# Altium schematic sheet V1.0.SchDoc
size 762 x 355 mm; SheetTotal: 3
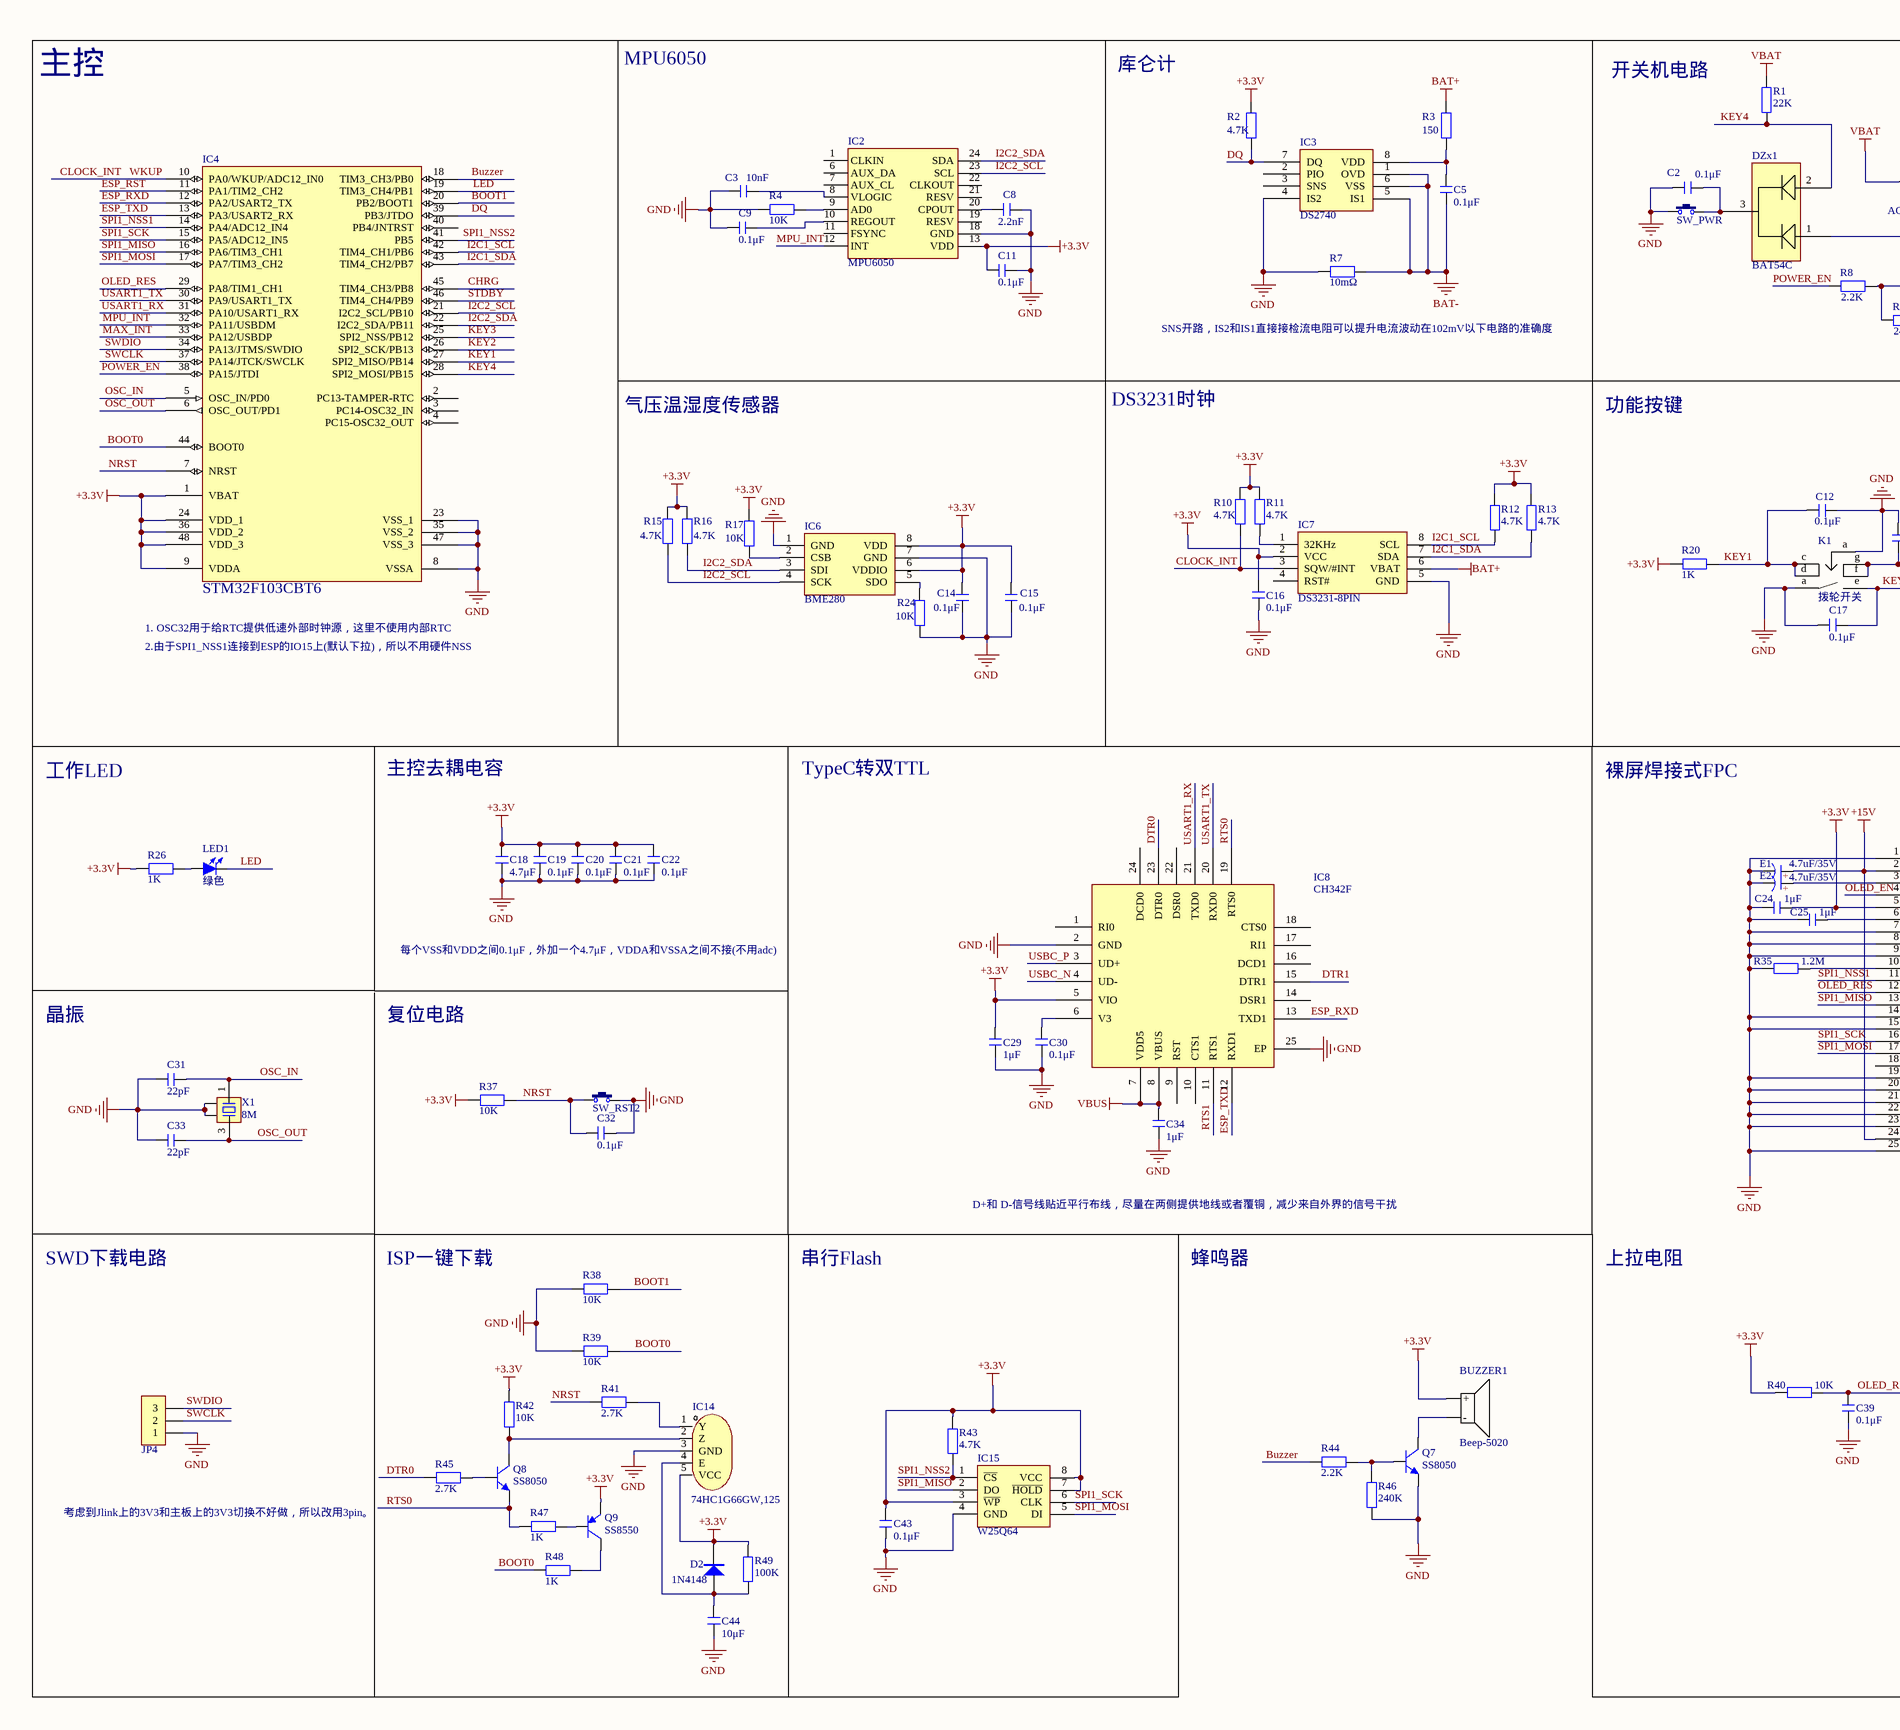
[diagram p0: V1.0.SchDoc, left]
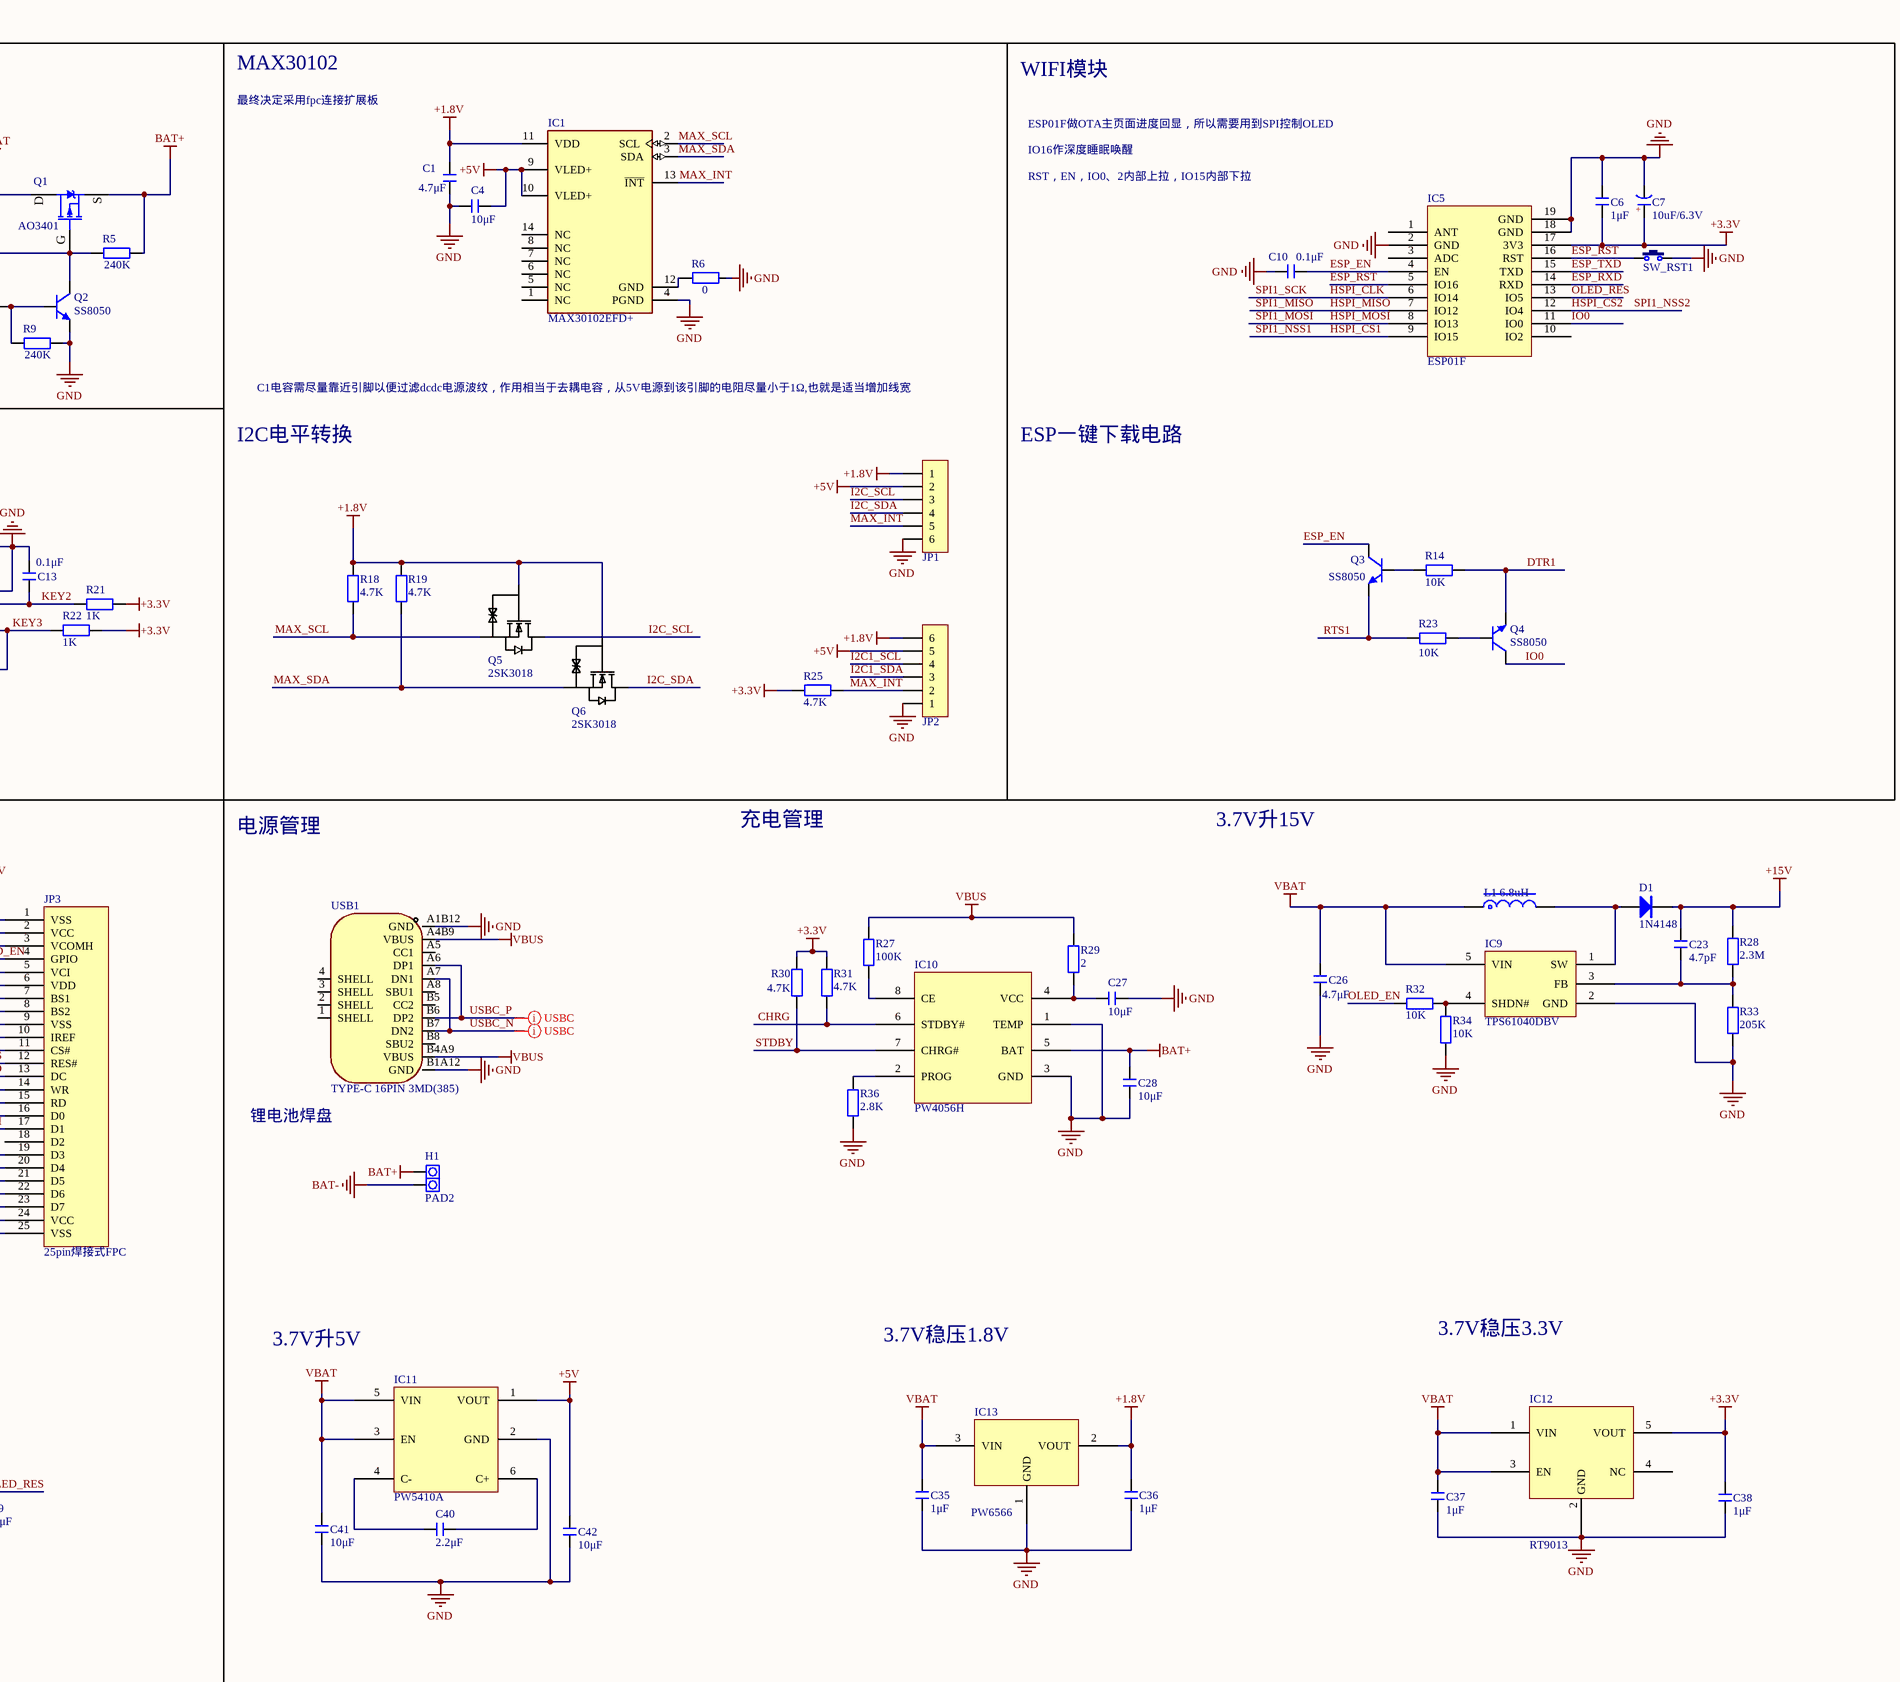
[diagram p1: V1.0.SchDoc, right]

## Parts
BUZZER1  Beep-5020  [5020BUZZER]
C1  4.7μF  [C 0603_L]
C2  0.1μF  [C 0603_L]
C3  10nF  [C 0603_L]
C4  10μF  [C 0603_L]
C5  0.1μF  [C 0603_L]
C6  1μF  [C 0603_L]
C7  10uF/6.3V  [CD A(3216)]
C8  2.2nF  [C 0603_L]
C9  0.1μF  [C 0603_L]
C10  0.1μF  [C 0603_L]
C11  0.1μF  [C 0603_L]
C12  0.1μF  [C 0603_L]
C13  0.1μF  [C 0603_L]
C14  0.1μF  [C 0603_L]
C15  0.1μF  [C 0603_L]
C16  0.1μF  [C 0603_L]
C17  0.1μF  [C 0603_L]
C18  4.7μF  [C 0603_L]
C19  0.1μF  [C 0603_L]
C20  0.1μF  [C 0603_L]
C21  0.1μF  [C 0603_L]
C22  0.1μF  [C 0603_L]
C23  4.7pF  [C 0603_L]
C24  1μF  [C 0603_L]
C25  1μF  [C 0603_L]
C26  4.7μF  [C 0603_L]
C27  10μF  [C 0603_L]
C28  10μF  [C 0603_L]
C29  1μF  [C 0603_L]
C30  0.1μF  [C 0603_L]
C31  22pF  [C 0603_L]
C32  0.1μF  [C 0603_L]
C33  22pF  [C 0603_L]
C34  1μF  [C 0603_L]
C35  1μF  [C 0603_L]
C36  1μF  [C 0603_L]
C37  1μF  [C 0603_L]
C38  1μF  [C 0603_L]
C39  0.1μF  [C 0603_L]
C40  2.2μF  [C 0603_L]
C41  10μF  [C 0603_L]
C42  10μF  [C 0603_L]
C43  0.1μF  [C 0603_L]
C44  10μF  [C 0603_L]
D1  1N4148  [SOD-123]
D2  1N4148  [SOD-323]
DZx1  BAT54C  [SOT23-3N]
E1  4.7uF/35V  [CD A(3216)]
E2  4.7uF/35V  [CD A(3216)]
H1  PAD2  [CHARGE_PAD]
IC1  MAX30102EFD+  [FP-F143A5-1-MFG]
IC2  MPU6050  [QFN24 4x4_M]
IC3  DS2740  [MSOP8_L]
IC4  STM32F103CBT6  [LQFP48 7X7_M]
IC5  ESP01F  [ESP-01F]
IC6  BME280  [BME280]
IC7  DS3231-8PIN  [SOP8_N]
IC8  CH342F  [QFN24]
IC9  TPS61040DBV  [SOT23-5L]
IC10  PW4056H  [SOP-8_L4.9-W3.9-P1.27-LS6.0-BL-EP3.1]
IC11  PW5410A  [SOT23-6]
IC12  RT9013  [SOT23-5L]
IC13  PW6566  [SOT23-3L]
IC14  74HC1G66GW,125  [SOT-353_L2.2-W1.4-P0.65-LS2.4-BR]
IC15  W25Q64  [SOP8W_N]
JP1  FPC1.0-6P  [FPC0.5 2H-WS-6P]  (value not drawn)
JP2  FPC1.0-6P  [FPC0.5 2H-WS-6P]  (value not drawn)
JP3  25pin焊接式FPC  [25pin焊接式FPC]
JP4  HDR-1X3  [HDR2.54-3P]  (value not drawn)
K1  拨轮开关  [拨轮开关]
L1  6.8uH  [NR3015]
LED1  绿色  [LED 0603G]
Q1  AO3401  [SOT23-3N]
Q2  SS8050  [SOT23-3N]
Q3  SS8050  [SOT23-3N]
Q4  SS8050  [SOT23-3N]
Q5  2SK3018  [SOT23-3L]
Q6  2SK3018  [SOT23-3L]
Q7  SS8050  [SOT23-3N]
Q8  SS8050  [SOT23-3N]
Q9  SS8550  [SOT23-3N]
R1  22K  [R 0603_L]
R2  4.7K  [R 0603_L]
R3  150  [R 0603_L]
R4  10K  [R 0603_L]
R5  240K  [R 0603_L]
R6  0  [R 0603_L]
R7  10mΩ  [R 0603_L]
R8  2.2K  [R 0603_L]
R9  240K  [R 0603_L]
R10  4.7K  [R 0603_L]
R11  4.7K  [R 0603_L]
R12  4.7K  [R 0603_L]
R13  4.7K  [R 0603_L]
R14  10K  [R 0603_L]
R15  4.7K  [R 0603_L]
R16  4.7K  [R 0603_L]
R17  10K  [R 0603_L]
R18  4.7K  [R 0603_L]
R19  4.7K  [R 0603_L]
R20  1K  [R 0603_L]
R21  1K  [R 0603_L]
R22  1K  [R 0603_L]
R23  10K  [R 0603_L]
R24  10K  [R 0603_L]
R25  4.7K  [R 0603_L]
R26  1K  [R 0603_L]
R27  100K  [R 0603_L]
R28  2.3M  [R 0603_L]
R29  2  [R 0603_L]
R30  4.7K  [R 0603_L]
R31  4.7K  [R 0603_L]
R32  10K  [R 0603_L]
R33  205K  [R 0603_L]
R34  10K  [R 0603_L]
R35  1.2M  [R 0603_L]
R36  2.8K  [R 0603_L]
R37  10K  [R 0603_L]
R38  10K  [R 0603_L]
R39  10K  [R 0603_L]
R40  10K  [R 0603_L]
R41  2.7K  [R 0603_L]
R42  10K  [R 0603_L]
R43  4.7K  [R 0603_L]
R44  2.2K  [R 0603_L]
R45  2.7K  [R 0603_L]
R46  240K  [R 0603_L]
R47  1K  [R 0603_L]
R48  1K  [R 0603_L]
R49  100K  [R 0603_L]
SW_PWR  3  [KEY-SMD_UK-B0264-SP25Y]  (value not drawn)
SW_RST1  3x4x2  [SW-SMD_L4.0-W3.0-LS4.6]  (value not drawn)
SW_RST2  3x4x2  [SW-SMD_L4.0-W3.0-LS4.6]  (value not drawn)
USB1  TYPE-C 16PIN 3MD(385)  [USB-C-SMD_KH-TYPE-C-16P]
X1  8M  [OSC 3225-4P]

## Blocks framed on the sheet
主控: IC4

## Nets
+1.8V: C1.1 C36.1 IC1.11(VDD) IC13.2(VOUT) JP1.1 JP2.6 Q5.1(G) Q6.1(G) R18.1 R19.1
+3.3V: BUZZER1.1(+) C6.1 C7.1(A) C11.2 C14.1 C15.1 C16.1 C18.2 C19.2 C20.2 C21.2 C22.2 C24.2 C29.1 C38.1 C43.2 D2.2(K) IC2.13(VDD) IC4.1(VBAT) IC4.9(VDDA) IC4.24(VDD_1) IC4.36(VDD_2) IC4.48(VDD_3) IC5.17(3V3) IC6.6(VDDIO) IC6.8(VDD) IC7.2(VCC) IC8.5(VIO) IC12.5(VOUT) IC14.5(VCC) IC15.3(~{WP}) IC15.7(~{HOLD}) IC15.8(VCC) JP3.5(VCI) Q9.2(E) R2.2 R10.1 R11.1 R12.1 R13.1 R15.1 R16.1 R17.2 R20.2 R21.2 R22.2 R25.2 R26.2 R30.2 R31.2 R37.2 R40.1 R42.1 R43.2 R49.2
+5V: C4.2 C42.1 IC1.9(VLED+) IC1.10(VLED+) IC11.1(VOUT) JP1.2 JP2.5
+15V: C23.2 D1.2(K) E1.1(A) JP3.2(VCC) JP3.24(VCC) R28.2
BAT+: C28.1 H1.+ IC7.6(VBAT) IC10.5(BAT) Q1.2(S) R3.2 R5.1
BAT-: C5.1 H1.- IC3.1(OVD) IC3.5(IS1) IC3.6(VSS) R7.1
GND: C1.2 C2.1 C3.2 C4.1 C6.2 C7.2(K) C8.1 C9.2 C10.1 C11.1 C12.2 C13.2 C14.2 C15.2 C16.2 C17.2 C18.1 C19.1 C20.1 C21.1 C22.1 C24.1 C25.1 C26.1 C27.1 C28.2 C29.2 C30.2 C31.2 C32.1 C33.2 C34.2 C35.2 C36.2 C37.2 C38.2 C39.1 C41.1 C42.2 C43.1 C44.2 E1.2(K) E2.2(K) IC1.4(PGND) IC2.18(GND) IC3.4(IS2) IC4.8(VSSA) IC4.23(VSS_1) IC4.35(VSS_2) IC4.47(VSS_3) IC5.2(GND) IC5.18(GND) IC5.19(GND) IC6.1(GND) IC6.7(GND) IC7.5(GND) IC8.2(GND) IC8.25(EP) IC9.2(GND) IC10.1(TEMP) IC10.3(GND) IC11.2(GND) IC12.2(GND) IC13.1(GND) IC14.3(GND) IC15.4(GND) JP1.6 JP2.1 JP3.1(VSS) JP3.7(BS1) JP3.8(BS2) JP3.9(VSS) JP3.14(WR) JP3.15(RD) JP3.19(D3) JP3.20(D4) JP3.21(D5) JP3.22(D6) JP3.23(D7) JP3.25(VSS) JP4.1 K1.a Q2.2(E) Q7.2(E) R4.2 R6.1 R7.2 R9.1 R24.1 R33.1 R34.1 R35.1 R36.1 R38.2 R39.2 R46.1 SW_PWR.2 SW_RST1.2 SW_RST2.2 USB1.A1B12(GND) USB1.B1A12(GND) X1.2 X1.4
VBAT: C26.2 C35.1 C37.1 C41.2 IC9.5(VIN) IC11.3(EN) IC11.5(VIN) IC12.1(VIN) IC12.3(EN) IC13.3(VIN) L1.1 Q1.3(D) R1.1
VBUS: C34.1 IC8.7(VDD5) IC8.8(VBUS) R27.2 R29.2 USB1.A4B9(VBUS) USB1.B4A9(VBUS)
BOOT0: IC4.44(BOOT0) R39.1 R48.1
BOOT1: IC4.20(PB2/BOOT1) R38.1
Buzzer: IC4.18(TIM3_CH3/PB0) R44.1
CHRG: IC4.45(TIM4_CH3/PB8) IC10.6(STDBY#) R31.1
CLOCK_INT: IC4.10(PA0/WKUP/ADC12_IN0) IC7.3(SQW/#INT) R10.2  [also labelled WKUP]
DQ: IC3.7(DQ) IC4.39(PB3/JTDO) R2.1
DTR0: IC8.23(DTR0) R45.1
DTR1: IC8.15(DTR1) Q4.2(E) R14.1
ESP_EN: C10.2 IC5.4(EN) Q3.3(C)
ESP_RST: IC4.11(PA1/TIM2_CH2) IC5.5(IO16) IC5.16(RST) SW_RST1.1
ESP_RXD: IC4.12(PA2/USART2_TX) IC5.14(RXD) IC8.13(TXD1)
ESP_TXD: IC4.13(PA3/USART2_RX) IC5.15(TXD) IC8.12(RXD1)
HSPI_CLK: IC4.15(PA5/ADC12_IN5) IC5.6(IO14) IC15.6(CLK) JP3.16(D0)  [also labelled SPI1_SCK]
HSPI_CS1: IC4.14(PA4/ADC12_IN4) IC5.9(IO15) JP3.11(CS#)  [also labelled SPI1_NSS1]
HSPI_CS2: IC4.41(PB5) IC5.12(IO4) IC15.1(~{CS}) R43.1  [also labelled SPI1_NSS2]
HSPI_MISO: IC4.16(PA6/TIM3_CH1) IC5.7(IO12) IC15.2(DO) JP3.13(DC)  [also labelled SPI1_MISO]
HSPI_MOSI: IC4.17(PA7/TIM3_CH2) IC5.8(IO13) IC15.5(DI) JP3.17(D1)  [also labelled SPI1_MOSI]
I2C1_SCL: IC4.42(TIM4_CH1/PB6) IC7.8(SCL) JP2.4 R12.2
I2C1_SDA: IC4.43(TIM4_CH2/PB7) IC7.7(SDA) JP2.3 R13.2
I2C2_SCL: IC2.23(SCL) IC4.21(I2C2_SCL/PB10) IC6.4(SCK) R15.2
I2C2_SDA: IC2.24(SDA) IC4.22(I2C2_SDA/PB11) IC6.3(SDI) R16.2
I2C_SCL: JP1.3 Q5.3(D)
I2C_SDA: JP1.4 Q6.3(D)
IO0: IC5.11(IO0) Q4.3(C)
KEY1: C12.1 IC4.27(SPI2_MISO/PB14) K1.c K1.d R20.1
KEY2: C13.1 IC4.26(SPI2_SCK/PB13) K1.f K1.g R21.1
KEY3: C17.1 IC4.25(SPI2_NSS/PB12) K1.e R22.1
KEY4: DZx1.2 IC4.28(SPI2_MOSI/PB15) R1.2
LED: IC4.19(TIM3_CH4/PB1) LED1.2(K)
MAX_INT: IC1.13(~{INT}) IC4.33(PA12/USBDP) JP1.5 JP2.2 R25.1
MAX_SCL: IC1.2(SCL) Q5.2(S) R18.2
MAX_SDA: IC1.3(SDA) Q6.2(S) R19.2
MPU_INT: IC2.12(INT) IC4.32(PA11/USBDM)
NRST: C32.2 IC4.7(NRST) R37.1 R41.1 SW_RST2.1
OLED_EN: JP3.4(GPIO) R32.2
OLED_RES: C39.2 IC4.29(PA8/TIM1_CH1) IC5.13(IO5) JP3.12(RES#) R40.2
OSC_IN: C31.1 IC4.5(OSC_IN/PD0) X1.1
OSC_OUT: C33.1 IC4.6(OSC_OUT/PD1) X1.3
POWER_EN: IC4.38(PA15/JTDI) R8.2
RTS0: IC8.19(RTS0) Q8.2(E) R47.2
RTS1: IC8.11(RTS1) Q3.2(E) R23.2
STDBY: IC4.46(TIM4_CH4/PB9) IC10.7(CHRG#) R30.1
SWCLK: IC4.37(PA14/JTCK/SWCLK) JP4.2
SWDIO: IC4.34(PA13/JTMS/SWDIO) JP4.3
USART1_RX: IC4.31(PA10/USART1_RX) IC8.21(TXD0)
USART1_TX: IC4.30(PA9/USART1_TX) IC8.20(RXD0)
USBC_N: IC8.4(UD-) USB1.A7(DN1) USB1.B7(DN2)
USBC_P: IC8.3(UD+) USB1.A6(DP1) USB1.B6(DP2)
NetBUZZER1_2: BUZZER1.2(-) Q7.3(C)
NetC2_2: C2.2 DZx1.3 SW_PWR.1
NetC3_1: C3.1 IC2.8(VLOGIC)
NetC5_2: C5.2 IC3.8(VDD) R3.1
NetC8_2: C8.2 IC2.20(CPOUT)
NetC9_1: C9.1 IC2.10(REGOUT)
NetC23_1: C23.1 IC9.3(FB) R28.1 R33.2
NetC25_2: C25.2 JP3.6(VDD)
NetC27_2: C27.2 IC10.4(VCC) R29.1
NetC30_1: C30.1 IC8.6(V3)
NetC40_1: C40.1 IC11.6(C+)
NetC40_2: C40.2 IC11.4(C-)
NetC44_1: C44.1 D2.1(A) IC14.4(E) R49.1
NetD1_1: D1.1(A) IC9.1(SW) L1.2
NetDZx1_1: DZx1.1 Q1.1(G) Q2.3(C) R5.2
NetE2_1: E2.1(A) JP3.3(VCOMH)
NetIC1_12: IC1.12(GND) R6.2
NetIC2_9: IC2.9(AD0) R4.1
NetIC6_2: IC6.2(CSB) R17.1
NetIC6_5: IC6.5(SDO) R24.2
NetIC7_1: IC7.1(32KHz) R11.2
NetIC9_4: IC9.4(SHDN#) R32.1 R34.2
NetIC10_2: IC10.2(PROG) R36.2
NetIC10_8: IC10.8(CE) R27.1
NetIC14_1: IC14.1(Y) R41.2
NetIC14_2: IC14.2(Z) Q8.3(C) R42.2
NetJP3_10: JP3.10(IREF) R35.2
NetLED1_1: LED1.1(A) R26.1
NetQ2_1: Q2.1(B) R8.1 R9.2
NetQ3_1: Q3.1(B) R14.2
NetQ4_1: Q4.1(B) R23.1
NetQ7_1: Q7.1(B) R44.2 R46.2
NetQ8_1: Q8.1(B) R45.2
NetQ9_1: Q9.1(B) R47.1
NetQ9_3: Q9.3(C) R48.2

Not connected (* = marked no-connect by the designer): IC1 1(NC) 5(NC) 6(NC) 7(NC) 8(NC) 14(NC); IC2 1(CLKIN) 6(AUX_DA) 7(AUX_CL) 11(FSYNC) 19(RESV) 21(RESV) 22(CLKOUT); IC3 2(PIO) 3(SNS); IC4 2(PC13-TAMPER-RTC) 3(PC14-OSC32_IN) 4(PC15-OSC32_OUT) 40(PB4/JNTRST); IC5 1(ANT) 3(ADC) 10(IO2); IC7 4(RST#); IC8 1(RI0) 9(RST) 10(CTS1) 14(DSR1) 16(DCD1) 17(RI1) 18(CTS0) 22(DSR0) 24(DCD0); IC12 4(NC); JP3 18(D2); USB1 1(SHELL) 2(SHELL) 3(SHELL) 4(SHELL) A5(CC1) A8(SBU1) B5(CC2) B8(SBU2)

## Layout directives
differential pair: USBC_N, USBC_P

## Notes on the sheet
- MPU6050
- 库仑计
- 开关机电路
- MAX30102
- 最终决定采用fpc连接扩展板
- WIFI模块
- IO16作深度睡眠唤醒
- ESP01F做OTA主页面进度回显，所以需要用到SPI控制OLED
- RST，EN，IO0、2内部上拉，IO15内部下拉
- SNS开路，IS2和IS1直接接检流电阻可以提升电流波动在102mV以下电路的准确度
- DS3231时钟
- C1电容需尽量靠近引脚以便过滤dcdc电源波纹，作用相当于去耦电容，从5V电源到该引脚的电阻尽量小于1Ω,也就是适当增加线宽
- 气压温湿度传感器
- 功能按键
- I2C电平转换
- ESP一键下载电路
- 1. OSC32用于给RTC提供低速外部时钟源，这里不使用内部RTC
- 2.由于SPI1_NSS1连接到ESP的IO15上(默认下拉)，所以不用硬件NSS
- 充电管理
- 3.7V升15V
- 工作LED
- 主控去耦电容
- TypeC转双TTL
- 裸屏焊接式FPC
- 电源管理
- 每个VSS和VDD之间0.1μF，外加一个4.7μF，VDDA和VSSA之间不接(不用adc)
- 晶振
- 复位电路
- 锂电池焊盘
- D+和 D-信号线贴近平行布线，尽量在两侧提供地线或者覆铜，减少来自外界的信号干扰
- 3.7V升5V
- 3.7V稳压1.8V
- 3.7V稳压3.3V
- SWD下载电路
- ISP一键下载
- 串行Flash
- 蜂鸣器
- 上拉电阻
- 考虑到Jlink上的3V3和主板上的3V3切换不好做，所以改用3pin。
- (in symbol C-CD) +

## Library data of the parts
BUZZER1 = Beep-5020: 贴片蜂鸣器5020最小封装
C1-C6 C8-C44 = C: 无极性贴片电容; 版权归属: 源创客; BOM名称: 无极性贴片电容; 学习资源: www.ooocke.com
C7 E1 E2 = C-CD: 贴片钽电容; 版权归属: 源创客; BOM名称: 贴片钽电容; 学习资源: www.ooocke.com
D1 D2 = 1N4148: 高速开关二极管; 版权归属: 源创客; BOM名称: 高速开关二极管; 学习资源: www.ooocke.com
DZx1 = BAT54C: 双肖特基，共阴极
H1 = PAD2: 引线焊盘; 版权归属: 源创客; BOM名称: 引线焊盘; 学习资源: www.ooocke.com
IC1 = MAX30102: IC SENSOR OXIMETER/HEARTRATE; Manufacturer: Maxim Integrated; Max Junction Temp: +90°C; Min Supply Voltage: 1.7V; Sensor Output: I2C; Operating Supply Current: 600uA; Max Supply Voltage: 2V; Package: F143A5-1; Manufacturer Part Number: MAX30102EFD+; Footprint Url: https://pdfserv.maximintegrated.com/land_patterns/90-0602.PDF; ComponentLink2URL: https://datasheets.maximintegrated.com/en/ds/MAX30102.pdf; Temperature: -40°C to +85°C; Device Class L2: unset; Mouser Description: Pulse Oximeter/Heart Rate Sensor, Oesip; Temperature Range High: +85°C; Automotive: No; Height: 1.65mm; Digikey Description: IC SENSOR OXIMETER/HEARTRATE; Category: IC; Lead Free: Yes; RoHS: TRUE; Temperature Range Low: -40°C; ComponentLink2Description: Datasheet; Octopart: https://octopart.com/max30102efd%2B-maxim+integrated-59568799; Device Class L3: unset; Device Class L1: Sensors
IC2 = MPU6050: 陀螺仪
IC3 = DS2740: 高精度库仑计
IC4 = STM32F103CB: Flash:128/RAM:20/IO:48; BOM名称: 32位STM单片机; 版权归属: 源创客; 学习资源: www.ooocke.com
IC5 = ESP01F: ESP-01F WiFi 模块是由安信可科技开发的，该模块核心处理器 ESP8285 在较小尺寸封装中集成了业界领先的 Tensilica L106 超低功耗 32 位微型 MCU，带有 16 位精简模式，主频支持 80 MHz 和 160 MH，支持 RTOS，集成 Wi-Fi MAC/BB/RF/PA/LNA。ESP-01F WiFi 模块支持标准的 IEEE802.11 b/g/n 协议，完整的 TCP/IP 协议栈。用户可以使用该模块为现有的设备添加联网功能，也可以构建独立的网络控制器
IC6 = BME280: 气压，湿度，温度传感器
IC8 = CH342F: 类型:-;协议类别:-;驱动器/接收器数:-;数据速率:-;; Manufacturer: WCH(南京沁恒); Symbol: CH342F; Device: CH342F; LCSC Part Name: CH342F; Supplier Part: C968586; Manufacturer Part: CH342F
IC9 = TPS61040DBV: 28V、400mA 开关升压转换器，适用于 LCD 和白光 LED
IC10 = PW4056H: PW4056H 是一款完整的采用恒定电流/恒定电压的高压、大电流、单节鲤离子电池线性充电IC，最高耐压可达 28V，6.5V 自动过压保护，充电电流可达 1A。
IC11 = PW5410A: 低噪声，恒频 1.2MHZ，输入电压范围2.7v-5v，5v固定输出电压，输出电流250mA的DCDC升压
IC12 = RT9013: RT9013是一款超低噪声、超低压差、超快速响应稳压器。它采用SOT23-5 (2.7mm X 1.4mm)/SC70-5( 1 8mm X 1.15mm )/DFN-6L( 2mm X 2mm )三种封装
IC13 = PW6566: PW6566 系列是使用 CMOS 技术开发的低压差，高精度 输出电压，低消耗电流正电压型电压稳压器
IC14 = 74HC1G66GW,125: 逻辑类型:SPST-NO;额外特性:-;; Manufacturer: Nexperia(安世); Add into BOM: yes; Number of Circuits/Elements: 1; Symbol: 74HC1G66GW,125; Device: 74HC1G66GW,125; LCSC Part Name: 74HC1G66GW,125; Supplier Part: C18566; Manufacturer Part: 74HC1G66GW,125; Supplier Footprint: SOT-353; JLCPCB Part Class: Extended Part; Datasheet: https://atta.szlcsc.com/upload/public/pdf/source/20160918/1474166836525.pdf; Supplier: LCSC; Convert to PCB: yes; Series: -; Logic Type: SPST-NO; Number of Inputs/Bits per Element: -; Voltage - Supply: -; Features: -
IC15 = W25Qxx: 外置Flash; 版权归属: 源创客; BOM名称: 外置Flash; 学习资源: www.ooocke.com
JP1 JP2 = FPC-6P: FPC连接器; 版权归属: 源创客; BOM名称: FPC连接器; 学习资源: www.ooocke.com
JP4 = Header 3: 3P接插件; 版权归属: 源创客; BOM名称: 3P接插件; 学习资源: www.ooocke.com
L1 = L-NR: NR磁胶电感; 版权归属: 源创客; BOM名称: NR磁胶电感; 学习资源: www.ooocke.com
LED1 = LED-SMD: 贴片LED; 版权归属: 源创客; BOM名称: 贴片LED; 学习资源: www.ooocke.com
Q1 = AO3401: P沟道场效应管; 版权归属: 源创客; BOM名称: P沟道场效应管; 学习资源: www.ooocke.com
Q2-Q4 Q7 Q8 = 8050-SMD: 高频放大-NPN型; 版权归属: 源创客; 属性: 40V 1.5A 1W 100MHZ; BOM名称: 高频放大-NPN型; 学习资源: www.ooocke.com
Q5 Q6 = 2SK3018: 类型:-;漏源电压(Vdss):-;连续漏极电流(Id):-;功率(Pd):-;导通电阻(RDS(on)@Vgs,Id):-;阈值电压(Vgs(th)@Id):-;栅极电荷(Qg@Vgs):-;输入电容(Ciss@Vds):-;反向传输电容(Crss@Vds):-;; Manufacturer: TWGMC(台湾迪嘉); Symbol: 2SK3018_C727148; Add into BOM: yes; Device: 2SK3018; LCSC Part Name: 2SK3018; Supplier Part: C727148; Manufacturer Part: 2SK3018; Supplier Footprint: SOT-23; JLCPCB Part Class: Extended Part; Datasheet: https://atta.szlcsc.com/upload/public/pdf/source/20200827/C727148_2301BBDB89FCE642A4A39ABEF7075607.pdf; Supplier: LCSC; Convert to PCB: yes; Type: -; Drain Source Voltage (Vdss): -; Continuous Drain Current (Id): -; Power Dissipation (Pd): -; Drain Source On Resistance (RDS(on)@Vgs,Id): -; Gate Threshold Voltage (Vgs(th)@Id): -; Total Gate Charge (Qg@Vgs): -; Input Capacitance (Ciss@Vds): -; Reverse Transfer Capacitance (Crss@Vds): -
Q9 = 8550-SMD: 高频放大-PNP型; 版权归属: 源创客; 属性: 40V 1.5A 1W 100MHZ; BOM名称: 高频放大-PNP型; 学习资源: www.ooocke.com
R1-R49 = R: 贴片电阻; 版权归属: 源创客; BOM名称: 贴片电阻; 学习资源: www.ooocke.com
SW_PWR = TSW 2x4x3.5: 2x4x3.5轻触开关; 版权归属: 源创客; BOM名称: 2x4x3.5轻触开关; 学习资源: www.ooocke.com
SW_RST1 SW_RST2 = TSW 3x4x2: 3x4x2开关; 版权归属: 源创客; BOM名称: 3x4x2开关; 学习资源: www.ooocke.com
USB1 = TYPE-C 16PIN 3MD(385): 连接器类型:Type-C;标准:-;公母:母座;触点数量:16;端口数量:1;安装方式:卧贴;额定电流 - 电源:3A;工作温度范围:-40℃~+85℃;; Manufacturer: SHOU HAN(首韩); Add into BOM: yes; Gender: 母座; Number of Contacts: 16; Number of Ports: 1; Current Rating - Power (Max): 3A; Symbol: TYPE-C 16PIN 3MD(385); Device: TYPE-C 16PIN 3MD(385); LCSC Part Name: Type-C 母座 卧贴; Supplier Part: C2858270; Manufacturer Part: TYPE-C 16PIN 3MD(385); Supplier Footprint: SMD; JLCPCB Part Class: Extended Part; Datasheet: https://atta.szlcsc.com/upload/public/pdf/source/20210728/C2858270_8CC81AF68E5F7ED0622FE1183F819D00.pdf; Supplier: LCSC; Convert to PCB: yes; Connector Type: Type-C; Standard: -; Mounting Style: 卧贴; Operating Temperature Range: -40℃~+85℃
X1 = XTAL-4P: 4脚无源晶振; 版权归属: 源创客; BOM名称: 4脚无源晶振; 学习资源: www.ooocke.com